# Altium schematic sheet 04_DCDC_3V3.SchDoc
size 209 x 297 mm; Author: Войлоков В. М.; CompanyName: ВГТУ РП-233; SheetNumber: 4; SheetTotal: 5; DecimalNumber: 123; Name1: Преобразователь; Name2: напряжения к 3.3В
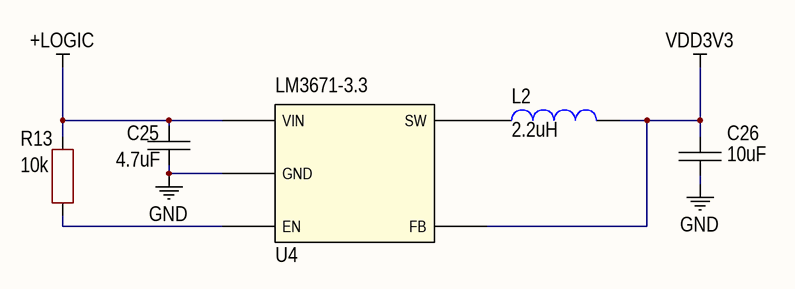
[diagram p0: 04_DCDC_3V3.SchDoc]

## Parts
C25  value 4.7uF  [CAP: 0805]
C26  value 10uF  [CAP: 0805]
L2  value 2.2uH  [IND: SDR0805]
R13  value 10k  [RES: 0603]
U4  LM3671-3.3  [SOT23-5]

## Nets
+LOGIC: C25.2 R13.2 U4.1(VIN)
GND: C25.1 C26.1 U4.2(GND)
VDD3V3: C26.2 L2.1 U4.4(FB)
NetL2_2: L2.2 U4.5(SW)
NetR13_1: R13.1 U4.3(EN)

## Notes on the sheet
- Перв.примен.
- Справ.№
- Подп. и дата
- Инв.№ дубл.
- Взам.инв.№
- Подп.и дата
- Разраб.
- Изм.
- Лист
- № докум.
- Подп.
- Дата
- Лит.
- Масштаб
- Масса
- Т.контр.
- Пров.
- СХЕМА   ЭЛЕКТРИЧЕСКАЯ
- ПРИНЦИПИАЛЬНАЯ
- Листов
- Инв.№ подл.
- Утв.
- Н.контр.
- Нач.сект.

## Library data of the parts
C25 = Ceramic_0805: Manufacturer: Yageo; PartNumber: CC0805KRX7R7BB104; ValueManufacturerPartNumber: Ceramic capacitor, 4.7uF, X7R, ±10%, 16V, 0805, -55...+125°C; TypeCapacitor: Ceramic capacitor; Tolerance: ±10%; TypeDielectric: X7R; Voltage: 16V; Package: 0805; HelpURL: https://www.digikey.com/product-detail/en/yageo/CC0805KRX7R7BB104/311-1142-1-ND/303052; Temperature: -55...+125°C
C26 = Ceramic_0805: Manufacturer: Yageo; PartNumber: CC0805KRX7R7BB104; ValueManufacturerPartNumber: Ceramic capacitor, 10uF, X7R, ±10%, 16V, 0805, -55...+125°C; TypeCapacitor: Ceramic capacitor; Tolerance: ±10%; TypeDielectric: X7R; Voltage: 16V; Package: 0805; HelpURL: https://www.digikey.com/product-detail/en/yageo/CC0805KRX7R7BB104/311-1142-1-ND/303052; Temperature: -55...+125°C
L2 = Inductor_SDR0805: Manufacturer: Bourns; PartNumber: SDR0805-4R7ML; ValueManufacturerPartNumber: Fixed inductor, 2.2uH, ±20%, SDR0805, 3.7A, -40...+125°C; TypeInductor: Fixed inductor; MaxCurrent: 3.7A; Tolerance: ±20%; Package: SDR0805; HelpURL: https://www.digikey.com/product-detail/en/bourns-inc/SDR0805-4R7ML/SDR0805-4R7MLCT-ND/2352947; Temperature: -40...+125°C
R13 = Resistor_0603: Manufacturer: Yageo; PartNumber: RC0603JR-07100RL; ValueManufacturerPartNumber: Resistor film, 10k, ±5%, 0603, 0.1W, -55...+125°C; TypeResistor: Resistor film; Power: 0.1W; Tolerance: ±5%; Package: 0603; HelpURL: https://www.digikey.com/product-detail/en/yageo/RC0603JR-07100RL/311-100GRCT-ND/729644; Temperature: -55...+125°C
U4 = LM3671-3.3: Manufacturer: Texas Instruments; Vin: 2.7V - 5.5V; Vout: 3.3V; Iout: 600 mA